# Altium schematic sheet Sheet_1_2021-12-08.schdoc
size 71 x 118 mm
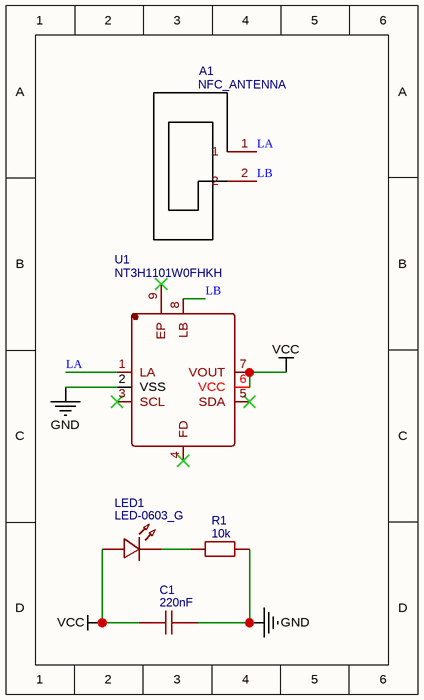
[diagram p0: Sheet_1_2021-12-08.schdoc]

## Parts
A1  NFC_ANTENNA  [NFC天线]
C1  220nF  [C0603]
LED1  LED-0603_G  [LED0603_GREEN]
R1  10k  [R0603]
U1  NT3H1101W0FHKH  [XQFN-8_L1.6-W1.6-P0.50-BR]

## Nets
GND: C1.2 R1.2 U1.2(VSS)
VCC: C1.1 LED1.1 U1.6(VCC) U1.7(VOUT)
LA: A1.1 U1.1(LA)
LB: A1.2 U1.8(LB)
NetLED1_2: LED1.2 R1.1

Not connected (* = marked no-connect by the designer): U1 3(SCL)* 4(FD)* 5(SDA)* 9(EP)*

## Library data of the parts
A1 = NFC_ANTENNA: Contributor: scarrr0725; BOM_Supplier: Z; spicePre: A; spiceSymbolName: NFC_ANTENNA
C1 = 220nF: nameAlias: Value(F); Contributor: LCEDA_Lib; spicePre: C; spiceSymbolName: C_0603_US
LED1 = LED-0603_G: BOM_Manufacturer: EVERLIGHT(台湾亿光); BOM_Manufacturer Part: 19-217/GHC-YR1S2/3T; Contributor: LCEDA_Lib; BOM_Supplier Part: C72043; BOM_Supplier: LCSC; spicePre: L; spiceSymbolName: LED-0603_G
R1 = 10k: nameAlias: Value(Ω); Contributor: LCEDA_Lib; spicePre: R; spiceSymbolName: R_0603_EU
U1 = NT3H1101W0FHKH: BOM_Manufacturer: NXP Semicon; Contributor: LCSC; BOM_Supplier: LCSC; BOM_Supplier Part: C73156; BOM_Manufacturer Part: NT3H1101W0FHKH; BOM_JLCPCB Part Class: Extended Part; spicePre: U; spiceSymbolName: NT3H1101W0FHKH